# EAGLE design unit_schematic_1_1 (EAGLE 9.3.0)
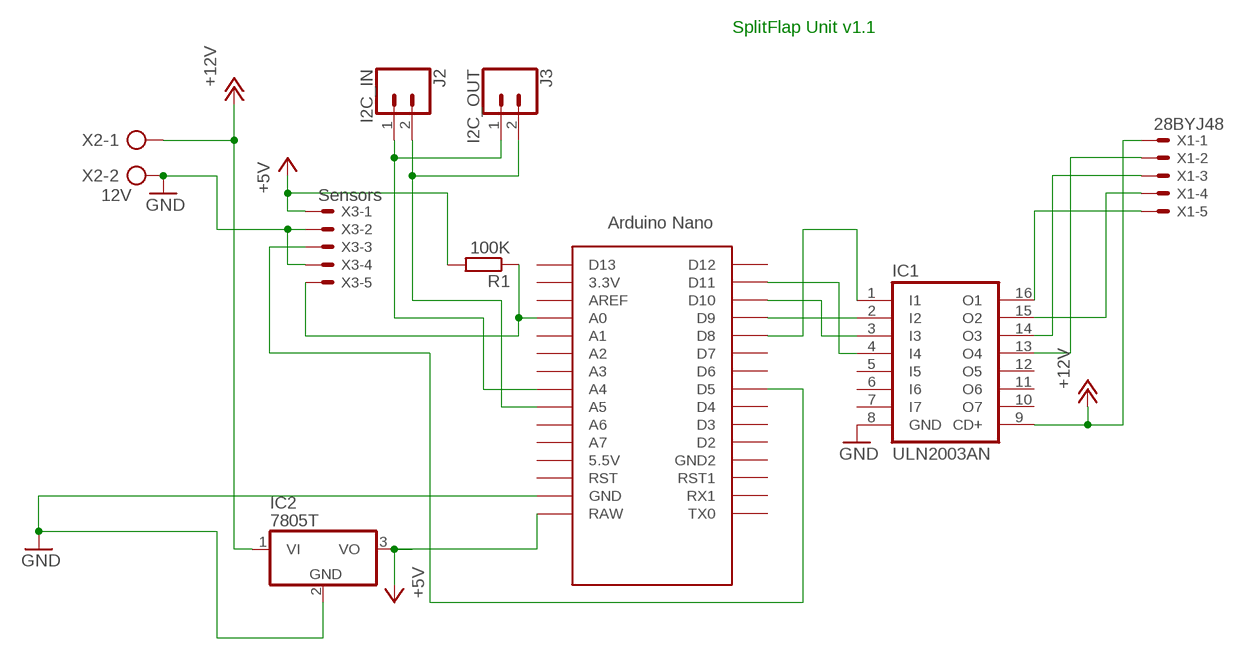
[diagram p0: schematic, sheet 1]

## Parts
IC1  ULN2003AN  [DIL16]
IC2  7805T  [TO220H]
J2  I2C_IN  CONN_02JST-PTH-2  [JST-2-PTH]
J3  I2C_OUT  CONN_02JST-PTH-2  [JST-2-PTH]
R1  100K  R-EU_0207/10  [0207/10]
U$2  NANO  [NANO]
X1  28BYJ48  JST-XH-05-PIN-ROUND-PAD  [JST-XH-05-PACKAGE-ROUND-PAD]
X2  12V  AK300/2  [AK300/2]
X3  Sensors  JST-XH-05-PIN-ROUND-PAD  [JST-XH-05-PACKAGE-ROUND-PAD]

## Nets
+5V: IC2.3(VO) R1.2 U$2.RAW X3.1
+12V: IC1.9(CD+) IC2.1(VI) X1.1 X2.1
GND: IC1.8(GND) IC2.2(GND) U$2.GND X2.2 X3.2 X3.4
N$1: IC1.1(I1) U$2.D8
N$2: R1.1 U$2.A0 X3.5
N$3: IC1.2(I2) U$2.D9
N$4: IC1.3(I3) U$2.D10
N$5: IC1.4(I4) U$2.D11
N$6: IC1.13(O4) X1.2
N$7: IC1.14(O3) X1.3
N$8: IC1.15(O2) X1.4
N$9: IC1.16(O1) X1.5
N$11: U$2.D5 X3.3
N$13: J2.2 J3.2 U$2.A5
N$14: J2.1 J3.1 U$2.A4
Unconnected: IC1.5(I5) IC1.6(I6) IC1.7(I7) IC1.10(O7) IC1.11(O6) IC1.12(O5) U$2.3.3V U$2.5V(5.5V) U$2.A1 U$2.A2 U$2.A3 U$2.A6 U$2.A7 U$2.AREF U$2.D2 U$2.D3 U$2.D4 U$2.D6 U$2.D7 U$2.D12 U$2.D13 U$2.GND1(GND2) U$2.ICSP1 U$2.ICSP2 U$2.ICSP3 U$2.ICSP4 U$2.ICSP5 U$2.ICSP6 U$2.RST U$2.RST1 U$2.RX1 U$2.TX0

## Notes on the sheet
- SplitFlap Unit v1.1

## Library data of the parts
IC1 = uln-udn:ULN2003A: DRIVER ARRAY
IC2 = linear:78*: Positive VOLTAGE REGULATOR Source: http://cache.national.com/ds/LM/LM78L05.pdf http://www.fairchildsemi.com/ds/LM/LM7805.pdf
J2 J3 = SparkFun-Connectors:CONN_02: Multi connection point. Often used as Generic Header-pin footprint for 0.1 inch spaced/style header connections On any of the 0.1 inch spaced packages, you can populate with these: Break Away Headers - Straight <https://www.sparkfun.com/products/116> (PRT-00116) Break Away Male Headers - Right Angle <https://www.sparkfun.com/products/553> (PRT-00553) Female Headers <https://www.sparkfun.com/products/115> (PRT-00115) Break Away Headers - Machine Pin <https://www.sparkfun.com/products/117> (PRT-00117) Break Away Female Headers - Swiss Machine Pin <https://www.sparkfun.com/products/743> (PRT-00743) For SCREWTERMINALS and SPRING TERMINALS visit here: Screw Terimnals on SparkFun.com <https://www.sparkfun.com/search/results?term=Screw+Terminals> (5mm/3.5mm/2.54mm spacing) This device is also useful as a general connection point to wire up your design to another part of your project. Our various solder wires solder well into these plated through hole pads. Hook-Up Wire - Assortment (Stranded, 22 AWG) <https://www.sparkfun.com/products/11375> (PRT-11375) Hook-Up Wire - Assortment (Solid Core, 22 AWG) <https://www.sparkfun.com/products/11367> (PRT-11367) View the entire wire category on our website here <https://www.sparkfun.com/categories/141> Special notes: Molex polarized connector foot print use with: PRT-08233 with associated crimp pins and housings. 2.54_SCREWTERM for use with PRT-10571. 3.5mm Screw Terminal footprints for PRT-08084 5mm Screw Terminal footprints for use with PRT-08432; PROD_ID: CONN-09863; SKU: PRT-09914
R1 = rcl:R-EU_: RESISTOR, European symbol; SPICEPREFIX: R
U$2 = Arduino-clone:NANO: Arduino Nano
X1 X3 = Rembrandt Electronics - JST XH Connectors v1-0:JST-XH-05-PIN: JST XH Connector 2 Pin Wire to board connector. Pitch: 2,54 mm, (0.100") Number of pins: 5 Created by Rembrandt Electronics www.rembrandtelectronics.com
X2 = con-ptr500:AK300/2: CONNECTOR; OC_FARNELL: unknown; OC_NEWARK: unknown

## Board
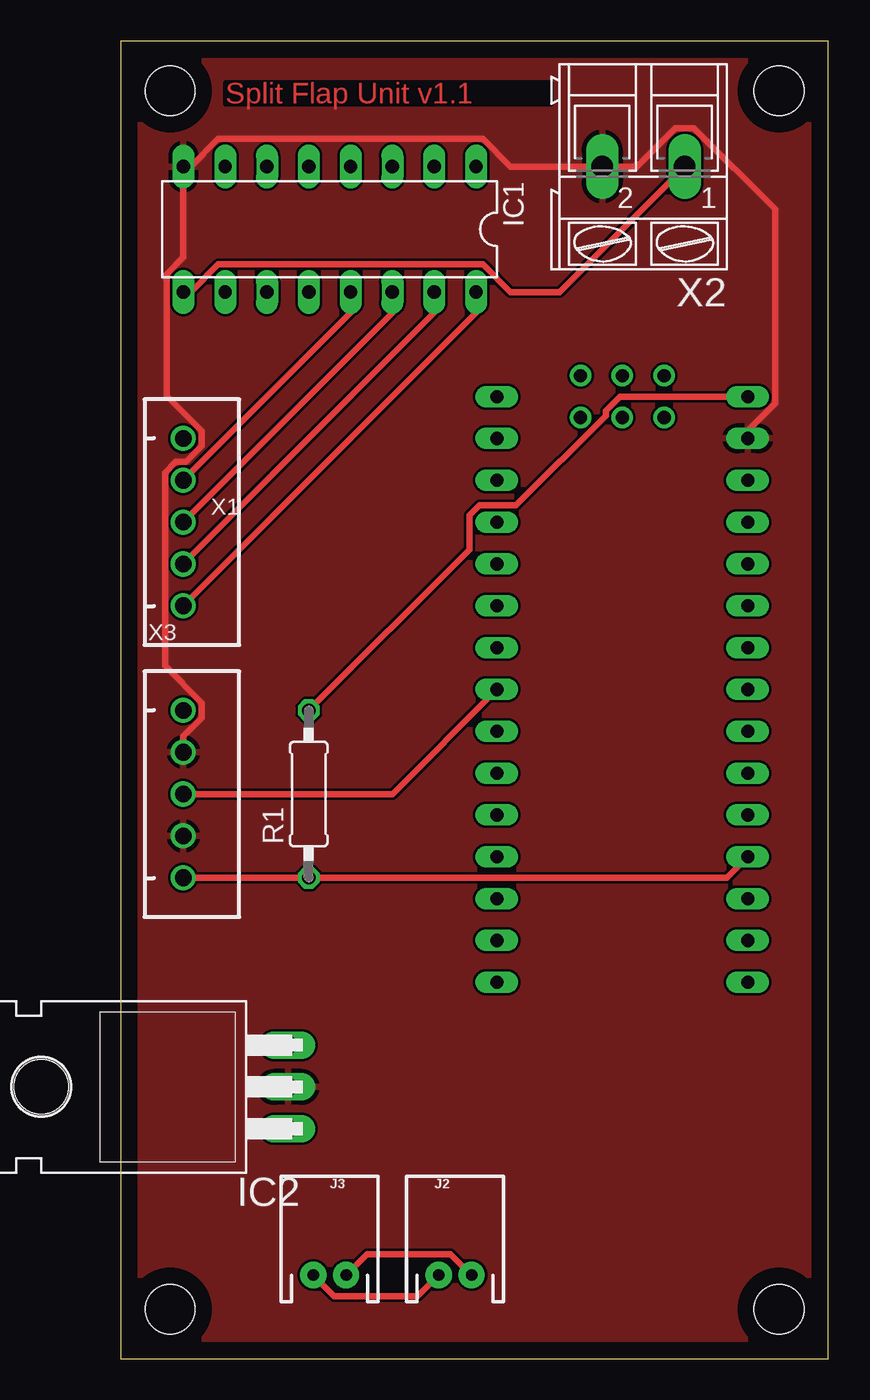
[diagram p1: board, top side]
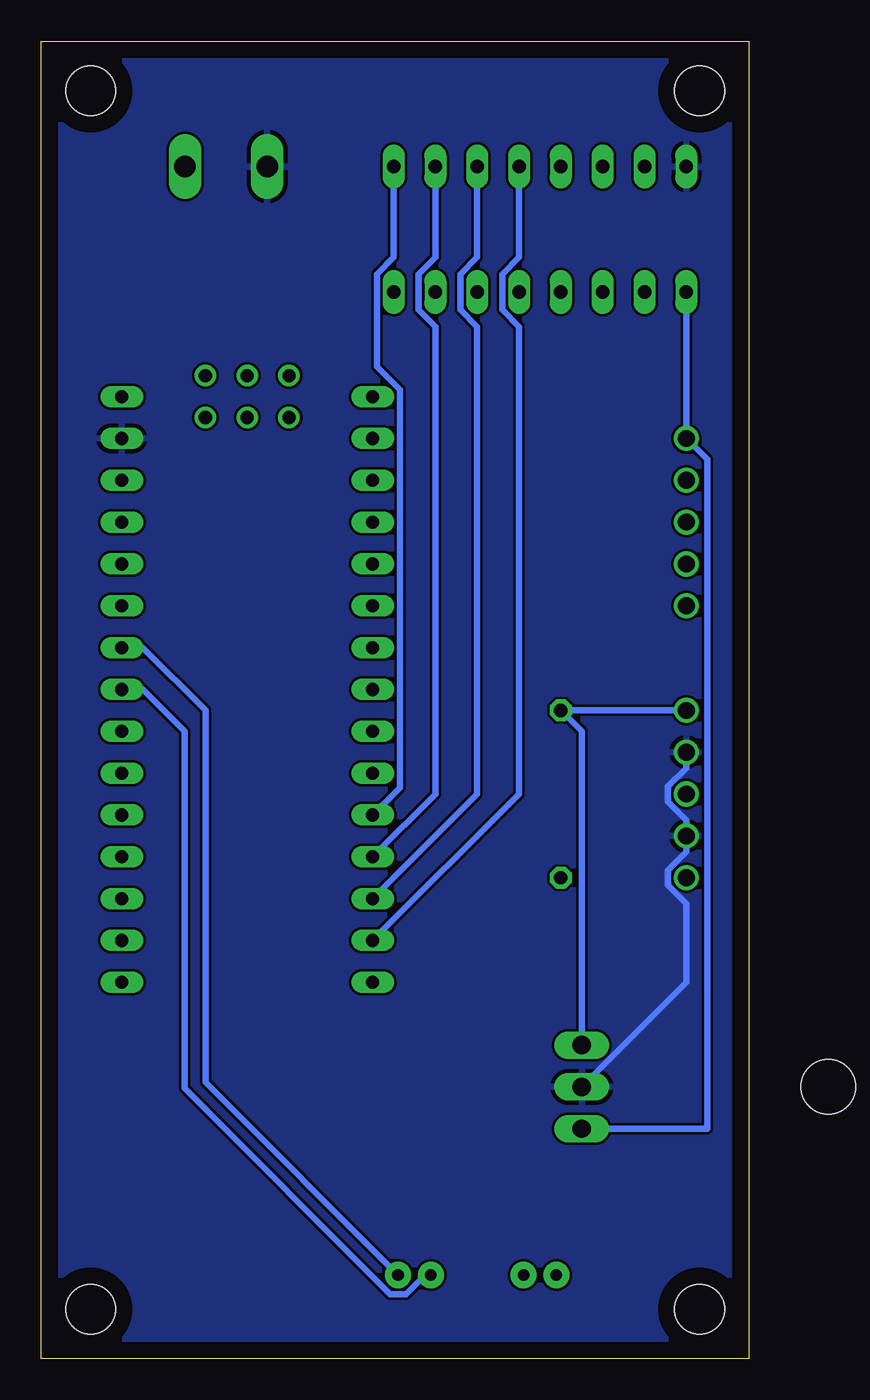
[diagram p2: board, bottom side, seen from below]

Size 43 x 80 mm. Coordinates in mm from the lower left corner, seen from the top.
Outline: 0,0 43,0 43,80 0,80 0,0
Copper layers (1*16): Top 0.035mm / dielectric 1.5mm / Bottom 0.035mm
Design rules "default": minimum track width 6mil, minimum drill 0.35mm, track to track 6mil, track to pad 6mil, pad to pad 6mil, via to via 6mil, smd to smd 6mil, copper to edge 40mil, drill to drill 6mil, minimum pad ring 10mil, minimum via ring 8mil, stop-mask expansion 4mil, vias tented up to drill 0mil, thermal gap 10mil
Holes 3 mm at 3,77 40,77 3,3 40,3

### Footprints (pad centres in the part's own frame; a part is rotated, then mirrored left to right if it is on the bottom)
DIL16 = drill 0.813 long: 1 -8.89,-3.81; 2 -6.35,-3.81; 3 -3.81,-3.81; 4 -1.27,-3.81; 5 1.27,-3.81; 6 3.81,-3.81; 7 6.35,-3.81; 8 8.89,-3.81; 9 8.89,3.81; 10 6.35,3.81; 11 3.81,3.81; 12 1.27,3.81; 13 -1.27,3.81; 14 -3.81,3.81; 15 -6.35,3.81; 16 -8.89,3.81
TO220H = drill 1.118 long: 1 -2.54,-10.16; 2 0,-10.16; 3 2.54,-10.16 | hole 3.302: 0,4.826
JST-2-PTH = drill 0.7 pad 1.6: 1 -1,0; 2 1,0
0207/10 = drill 0.813 octagon: 1 -5.08,0; 2 5.08,0
NANO = drill 0.8 long: 3.3V -10.16,24.13; 5V -10.16,-1.27; A0 -10.16,19.05; A1 -10.16,16.51; A2 -10.16,13.97; A3 -10.16,11.43; A4 -10.16,8.89; A5 -10.16,6.35; A6 -10.16,3.81; A7 -10.16,1.27; AREF -10.16,21.59; D2 5.08,1.27; D3 5.08,3.81; D4 5.08,6.35; D5 5.08,8.89; D6 5.08,11.43; D7 5.08,13.97; D8 5.08,16.51; D9 5.08,19.05; D10 5.08,21.59; D11 5.08,24.13; D12 5.08,26.67; D13 -10.16,26.67; GND -10.16,-6.35; GND1 5.08,-1.27; RAW -10.16,-8.89; RST -10.16,-3.81; RST1 5.08,-3.81; RX1 5.08,-6.35; TX0 5.08,-8.89 | drill 0.8: ICSP1 -5.08,-10.16; ICSP2 -5.08,-7.62; ICSP3 -2.54,-10.16; ICSP4 -2.54,-7.62; ICSP5 0,-10.16; ICSP6 0,-7.62
JST-XH-05-PACKAGE-ROUND-PAD = drill 1.016: 1 -5.08,0; 2 -2.54,0; 3 0,0; 4 2.54,0; 5 5.08,0
AK300/2 = drill 1.321 long: 1 -2.515,0; 2 2.489,0

### Placement (x,y rotation side)
IC1  12.7,68.58 180 top
IC2  0,16.51 90 top
J2  20.32,5.08 0 top
J3  12.7,5.08 0 top
R1  11.43,34.29 90 top
U$2  27.94,49.53 180 top
X1  3.81,50.8 270 top
X2  31.75,72.39 180 top
X3  3.81,34.29 270 top

### Tracks (layer width: path | path; a pad name or v marks a point on that pad's centre or on a via)
+5V
  Top 0.406: R1.2 21.2,49.14 21.2,51.22 21.79,51.81 24.03,51.81 29.47,57.25 29.47,57.57 30.32,58.42 U$2.RAW
  Bottom 0.406: X3.1 R1.2 10.16,38.1 IC2.3
+12V
  Top 0.406: X2.1 26.64,64.77 23.69,64.77 22.01,66.45 5.93,66.45 4.25,64.77 IC1.9
  Bottom 0.406: IC2.1 2.54,13.97 2.54,54.61 X1.1 IC1.9
GND
  Top 0.406: U$2.GND 38.1,56.34 39.76,58 39.76,69.78 34.82,74.73 33.71,74.73 31.37,72.39 X2.2 23.69,72.39 22.01,74.07 5.93,74.07 4.25,72.39 IC1.8 3.81,66.87 2.79,65.85 2.79,58.48 4.93,56.34 4.93,55.42 3.97,54.46 3.35,54.46 2.69,53.8 2.69,42.07 4.93,39.83 4.93,38.91 3.81,37.79 X3.2
  Bottom 0.406: IC2.2 3.81,22.86 3.81,27.63 4.93,28.75 4.93,29.67 3.81,30.79 X3.4 3.81,32.71 4.93,33.83 4.93,34.75 3.81,35.87 X3.2
  pour Top: 0,80.01 0,0 43.18,0 43.18,80.01
  pour Bottom: 0,80.01 0,0 43.18,0 43.18,80.01
N$1
  Bottom 0.406: IC1.1 21.59,66.87 22.61,65.85 22.61,60.25 21.2,58.84 21.2,34.68 21.59,34.29 U$2.D8
N$2
  Top 0.406: X3.5 R1.1 36.83,29.21 U$2.A0
N$3
  Bottom 0.406: U$2.D9 19.05,34.29 19.05,62.67 20.07,63.69 20.07,65.85 19.05,66.87 IC1.2
N$4
  Bottom 0.406: U$2.D10 16.51,34.29 16.51,62.67 17.53,63.69 17.53,65.85 16.51,66.87 IC1.3
N$5
  Bottom 0.406: U$2.D11 13.97,34.29 13.97,62.67 14.99,63.69 14.99,65.85 13.97,66.87 IC1.4
N$6
  Top 0.406: X1.2 13.97,63.5 IC1.13
N$7
  Top 0.406: X1.3 16.51,63.5 IC1.14
N$8
  Top 0.406: X1.4 19.05,63.5 IC1.15
N$9
  Top 0.406: X1.5 21.59,63.5 IC1.16
N$11
  Top 0.406: X3.3 16.51,34.29 U$2.D5
N$13
  Top 0.406: J3.2 14.97,6.35 20.05,6.35 J2.2
  Bottom 0.406: J2.2 33.02,16.78 33.02,39.37 36.83,43.18 U$2.A5
N$14
  Top 0.406: J3.1 12.97,3.81 18.05,3.81 J2.1
  Bottom 0.406: J2.1 19.69,5.08 20.84,3.92 21.8,3.92 34.29,16.42 34.29,38.1 36.83,40.64 U$2.A4

### Text on the board
Top: Split Flap Unit v1.1